# Altium schematic sheet 02_Microcontroller.SchDoc
size A4; Author: Sasa Karanovic; Organization: Altium Limited; sk_Title: Microcontroller; DocumentNumber: 1; Revision: 1.0; SheetNumber: 2; SheetTotal: 5
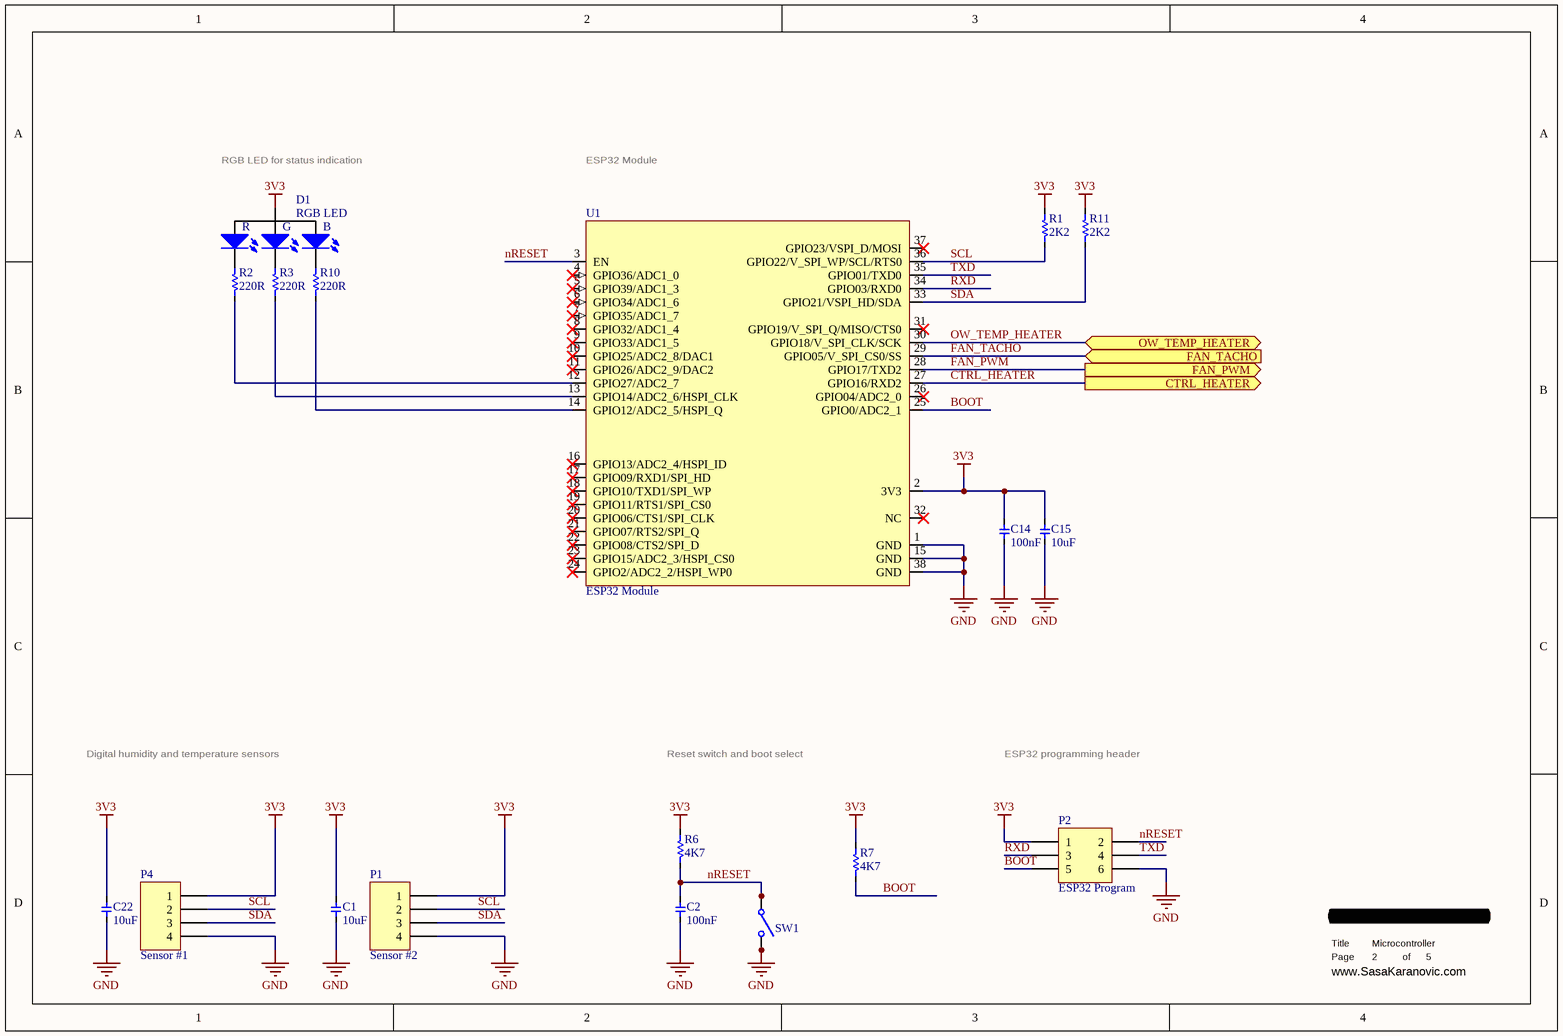
[diagram p0: 02_Microcontroller.SchDoc]

## Parts
C1  value 10uF  [0603 - CAP HS]  (hidden comment: Cap)
C2  value 100nF  [0603 - CAP HS]  (hidden comment: Cap)
C14  value 100nF  [0603 - CAP HS]  (hidden comment: Cap)
C15  value 10uF  [0603 - CAP HS]  (hidden comment: Cap)
C22  value 10uF  [0603 - CAP HS]  (hidden comment: Cap)
D1  RGB LED  [RGB LED - 0606 (1616 Metric)]
P1  Sensor #2  [Header 4x1]
P2  ESP32 Program  [HDR2X3]
P4  Sensor #1  [Header 4x1]
R1  value 2K2  [0603 - HS]  (hidden comment: Res)
R2  value 220R  [0603 - HS]  (hidden comment: Res)
R3  value 220R  [0603 - HS]  (hidden comment: Res)
R6  value 4K7  [0603 - HS]  (hidden comment: Res)
R7  value 4K7  [0603 - HS]  (hidden comment: Res)
R10  value 220R  [0603 - HS]  (hidden comment: Res)
R11  value 2K2  [0603 - HS]  (hidden comment: Res)
SW1  SWITCH TACTILE SPST-NO 0.05A 12V  [5mm_5mm_Switch_SMT]  (value not drawn)
U1  ESP32 Module  [ESP32-WROOM-32]

## Ports
CTRL_HEATER (out), FAN_PWM (out), FAN_TACHO (in), OW_TEMP_HEATER (bidir)

## Nets
3V3: C1.1 C14.1 C15.1 C22.1 D1.4 P1.1 P2.1 P4.1 R1.2 R6.2 R7.2 R11.2 U1.2(3V3)
GND: C1.2 C2.2 C14.2 C15.2 C22.2 P1.4 P2.6 P4.4 SW1.3(COMMON2) SW1.4(COMMON2) U1.1(GND) U1.15(GND) U1.38(GND)
BOOT: P2.5 R7.1 U1.25(GPIO0/ADC2_1)
CTRL_HEATER: U1.27(GPIO16/RXD2) ; port CTRL_HEATER
FAN_PWM: U1.28(GPIO17/TXD2) ; port FAN_PWM
FAN_TACHO: U1.29(GPIO05/V_SPI_CS0/SS) ; port FAN_TACHO
nRESET: C2.1 P2.2 R6.1 SW1.1(COMMON1) SW1.2(COMMON1) U1.3(EN)
OW_TEMP_HEATER: U1.30(GPIO18/V_SPI_CLK/SCK) ; port OW_TEMP_HEATER
RXD: P2.3 U1.34(GPIO03/RXD0)
SCL: P1.2 P4.2 R1.1 U1.36(GPIO22/V_SPI_WP/SCL/RTS0)
SDA: P1.3 P4.3 R11.1 U1.33(GPIO21/VSPI_HD/SDA)
TXD: P2.4 U1.35(GPIO01/TXD0)
NetD1_1: D1.1 R2.2
NetD1_2: D1.2 R3.2
NetD1_3: D1.3 R10.2
NetR2_1: R2.1 U1.12(GPIO27/ADC2_7)
NetR3_1: R3.1 U1.13(GPIO14/ADC2_6/HSPI_CLK)
NetR10_1: R10.1 U1.14(GPIO12/ADC2_5/HSPI_Q)

Not connected (* = marked no-connect by the designer): U1 4(GPIO36/ADC1_0)* 5(GPIO39/ADC1_3)* 6(GPIO34/ADC1_6)* 7(GPIO35/ADC1_7)* 8(GPIO32/ADC1_4)* 9(GPIO33/ADC1_5)* 10(GPIO25/ADC2_8/DAC1)* 11(GPIO26/ADC2_9/DAC2)* 16(GPIO13/ADC2_4/HSPI_ID)* 17(GPIO09/RXD1/SPI_HD)* 18(GPIO10/TXD1/SPI_WP)* 19(GPIO11/RTS1/SPI_CS0)* 20(GPIO06/CTS1/SPI_CLK)* 21(GPIO07/RTS2/SPI_Q)* 22(GPIO08/CTS2/SPI_D)* 23(GPIO15/ADC2_3/HSPI_CS0)* 24(GPIO2/ADC2_2/HSPI_WP0)* 26(GPIO04/ADC2_0)* 31(GPIO19/V_SPI_Q/MISO/CTS0)* 32(NC)* 37(GPIO23/VSPI_D/MOSI)*

## Notes on the sheet
- RGB LED for status indication
- ESP32 Module
- Digital humidity and temperature sensors
- Reset switch and boot select
- ESP32 programming header
- Page
- Title
- www.SasaKaranovic.com <http://www.SasaKaranovic.com>
- of
- (in symbol EAST1616RGBB2) R; G; B

## Library data of the parts
C1 C15 C22 = Cap: Capacitor; Manufacturer: Samsung Electro-Mechanics; Manufacturer Part Number: CL10A106MO8NQNC; Distributor Part Number: 1276-1870-1-ND; Distributor: DigiKey
C2 C14 = Cap: Capacitor; Manufacturer: Samsung Electro-Mechanics; Manufacturer Part Number: CL10B103KB8NNNC; Distributor Part Number: 1276-1009-1-ND; Distributor: DigiKey
D1 = EAST1616RGBB2: Red, Green, Blue (RGB) - LED Indication - Discrete 1.9V Red, 2.8V Green, 2.8V Blue 0606 (1616 Metric); Manufacturer: Everlight Electronics Co Ltd; Manufacturer Part Number: EAST1616RGBB2; Distributor: DigiKey; Distributor Part Number: 1080-1551-1-ND
P1 P4 = Header 4: Header, 4-Pin
P2 = Header 3X2: Header, 3-Pin, Dual row
R1 R11 = Res: Resistor; Manufacturer: Stackpole Electronics Inc; Manufacturer Part Number: RMCF0603JT2K20; Distributor: DigiKey; Distributor Part Number: RMCF0603JT2K20CT-ND
R2 R3 R10 = Res: Resistor; Manufacturer: Stackpole Electronics Inc; Manufacturer Part Number: RMCF0603FT220R; Distributor: DigiKey; Distributor Part Number: RMCF0603FT220RCT-ND
R6 R7 = Res: Resistor; Manufacturer: Stackpole Electronics Inc; Manufacturer Part Number: RMCF0603FT4K70; Distributor: DigiKey; Distributor Part Number: RMCF0603FT4K70CT-ND
SW1 = PTS645SL50SMTR92 LFS: Manufacturer: C&K; Distributor Part Number: CKN9088CT-ND; Manufacturer Part Number: PTS645SL50SMTR92 LFS; Distributor: DigiKey
U1 = ESP32_Module: Manufacturer Part Number: ESP32-WROOM-32D (4MB HIGH TEMP); Manufacturer: Espressif Systems